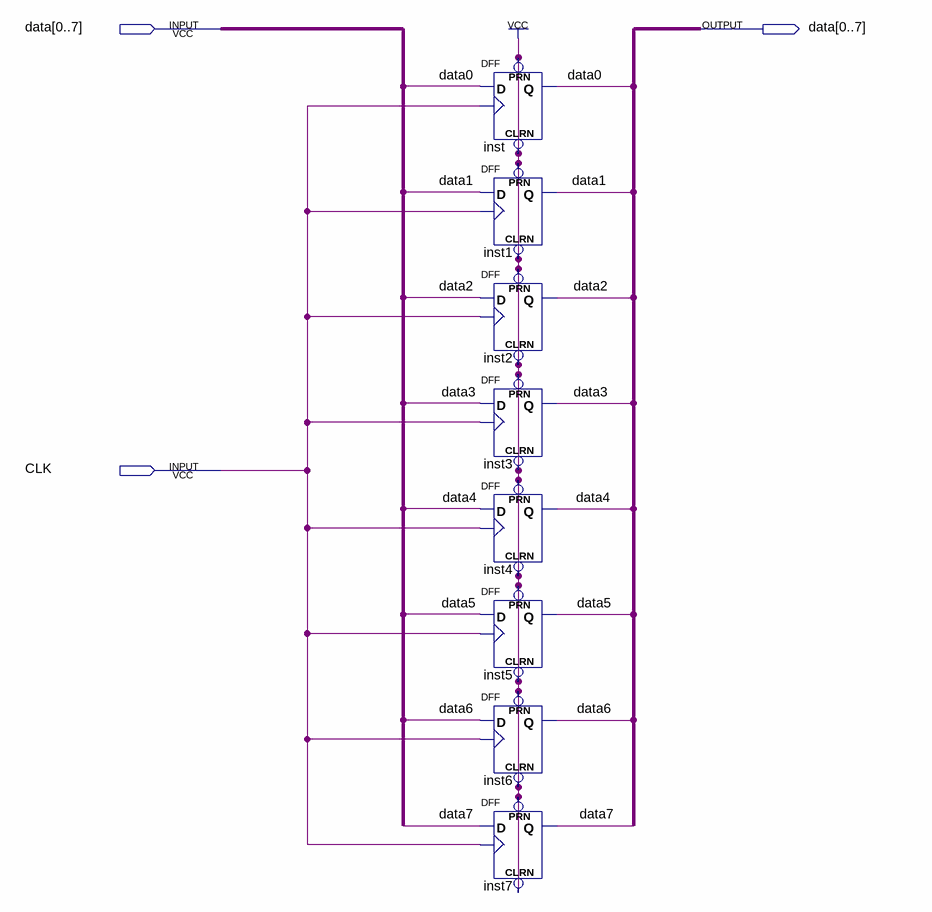
[diagram p0: schematic sheet]
// Quartus schematic program-counter.bdf as structural Verilog: 8 symbols, 3 pins
module \program-counter  (
  inout  [0:7] data,
  input  CLK
);

  DFF inst (.CLRN(1'b1), .CLK(CLK), .D(data[0]), .PRN(1'b1), .Q(data[0]));
  DFF inst1 (.CLRN(1'b1), .CLK(CLK), .D(data[1]), .PRN(1'b1), .Q(data[1]));
  DFF inst2 (.CLRN(1'b1), .CLK(CLK), .D(data[2]), .PRN(1'b1), .Q(data[2]));
  DFF inst3 (.CLRN(1'b1), .CLK(CLK), .D(data[3]), .PRN(1'b1), .Q(data[3]));
  DFF inst4 (.CLRN(1'b1), .CLK(CLK), .D(data[4]), .PRN(1'b1), .Q(data[4]));
  DFF inst5 (.CLRN(1'b1), .CLK(CLK), .D(data[5]), .PRN(1'b1), .Q(data[5]));
  DFF inst6 (.CLRN(1'b1), .CLK(CLK), .D(data[6]), .PRN(1'b1), .Q(data[6]));
  DFF inst7 (.CLRN(1'b1), .CLK(CLK), .D(data[7]), .PRN(1'b1), .Q(data[7]));
endmodule
